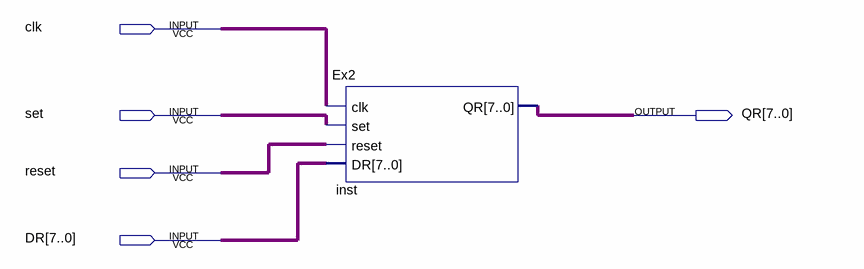
[diagram p0: schematic sheet]
// Quartus schematic Ex2_SCHEME.bdf as structural Verilog: 1 symbols, 5 pins
module Ex2_SCHEME (
  input  clk,
  input  set,
  input  reset,
  input  [7:0] DR,
  output [7:0] QR
);

  Ex2 inst (.clk(clk), .set(set), .reset(reset), .DR(DR), .QR(QR));
endmodule
